# Altium project Naxida_Eyes_Up.PrjPcb
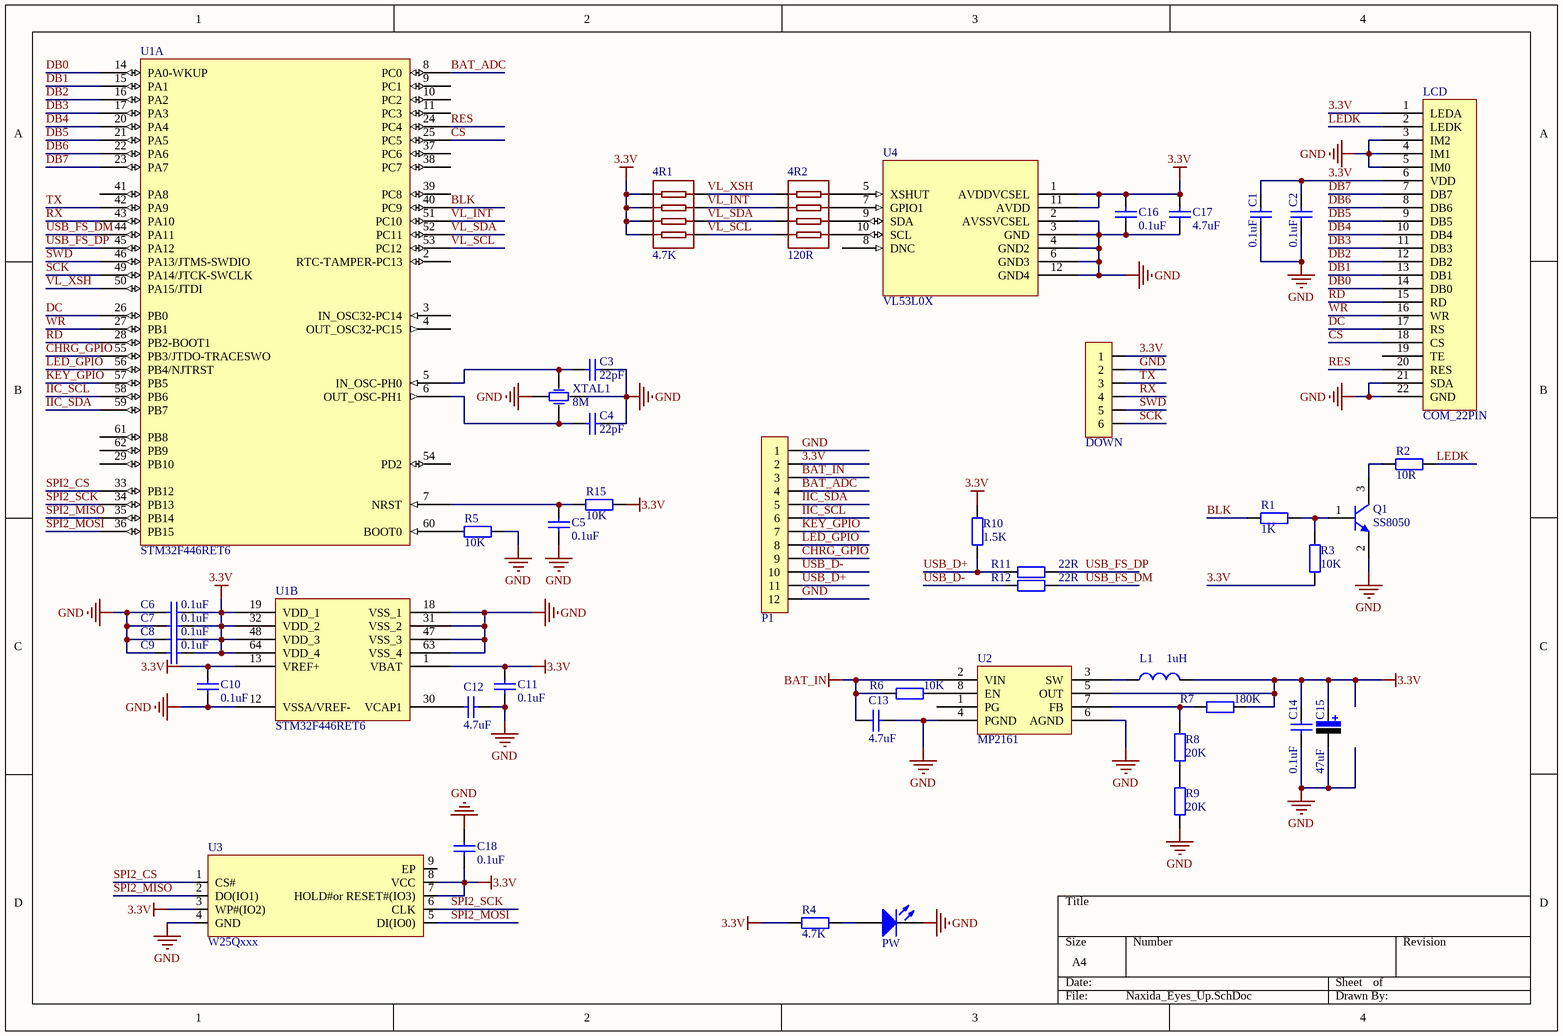
[diagram p0: Naxida_Eyes_Up.SchDoc]
1 sheet, 44 parts. Net scope: global (net labels, ports and power ports of the same name join across sheets).
Board file: Naxida_Eyes_Up.PcbDoc

## Sheet Naxida_Eyes_Up.SchDoc
size A4

### Parts
4R1  4.7K  [R_4R]
4R2  120R  [R_4R]
C1  0.1uF  [LC-0603_C]
C2  0.1uF  [LC-0603_C]
C3  value 22pF  [LC-0603_C]  (hidden comment: Cap)
C4  value 22pF  [LC-0603_C]  (hidden comment: Cap)
C5  0.1uF  [LC-0603_C]
C6  0.1uF  [LC-0603_C]
C7  0.1uF  [LC-0603_C]
C8  0.1uF  [LC-0603_C]
C9  0.1uF  [LC-0603_C]
C10  0.1uF  [LC-0603_C]
C11  0.1uF  [LC-0603_C]
C12  4.7uF  [LC-0603_C]
C13  4.7uF  [LC-1206_C]
C14  0.1uF  [LC-0603_C]
C15  47uF  [CAP-3528]
C16  0.1uF  [LC-0603_C]
C17  4.7uF  [LC-0603_C]
C18  0.1uF  [LC-0603_C]
DOWN  Header 6*1  [COM_W_2.0_6P]  (value not drawn)
L1  value 1uH  [Inductor-SWPA4030]  (hidden comment: Inductor)
LCD  COM_22PIN  [FPC_22PIN_0.5]
P1  Header 12*1  [HDR12X1_A-1.27mm]  (value not drawn)
PW  LED0  [LC-0603_LED_S1]  (value not drawn)
Q1  SS8050  [SOT-23]
R1  1K  [LC-0603_R]
R2  10R  [LC-0603_R]
R3  10K  [LC-0603_R]
R4  value 4.7K  [LC-0603_R]  (hidden comment: Res1)
R5  10K  [LC-0603_R]
R6  10K  [LC-0603_R]
R7  180K  [LC-0603_R]
R8  20K  [LC-0603_R]
R9  20K  [LC-0603_R]
R10  1.5K  [LC-0603_R]
R11  22R  [LC-0603_R]
R12  22R  [LC-0603_R]
R15  10K  [LC-0603_R]
U1  STM32F446RET6  [LQFP64_L]  (parts A,B of 2)
U2  MP2161  [SOT-23-8_MP2161]
U3  W25Qxxx  [WSON-8_W25Qxxx]
U4  VL53L0X  [VL53L0X]
XTAL1  8M  [XTAL_3225_4Pin]

### Nets
3.3V: 4R1.1 4R1.2 4R1.3 4R1.4 C1.2 C2.2 C6.2 C7.2 C8.2 C9.2 C10.2 C11.2 C14.2 C15.1 C16.2 C17.2 C18.1 DOWN.1 L1.2 LCD.1(LEDA) LCD.6(VDD) P1.2 R3.2 R4.1 R7.1 R10.1 R15.1 U1.1(VBAT) U1.13(VREF+) U1.19(VDD_1) U1.32(VDD_2) U1.48(VDD_3) U1.64(VDD_4) U2.5(OUT) U3.3(WP#(IO2)) U3.7(HOLD#or_RESET#(IO3)) U3.8(VCC) U4.1(AVDDVCSEL) U4.11(AVDD)
BAT_IN: C13.2 P1.3 R6.2 U2.2(VIN)
GND: C1.1 C2.1 C3.2 C4.2 C5.1 C6.1 C7.1 C8.1 C9.1 C10.1 C11.1 C12.1 C13.1 C14.1 C15.2 C16.1 C17.1 C18.2 DOWN.2 LCD.3(IM2) LCD.4(IM1) LCD.5(IM0) LCD.21(SDA) LCD.22(GND) P1.1 P1.12 PW.2(K) Q1.2(E) R5.1 R9.2 U1.12(VSSA/VREF-) U1.18(VSS_1) U1.31(VSS_2) U1.47(VSS_3) U1.63(VSS_4) U2.4(PGND) U2.6(AGND) U3.4(GND) U4.2(AVSSVCSEL) U4.3(GND) U4.4(GND2) U4.6(GND3) U4.12(GND4) XTAL1.2 XTAL1.4
BAT_ADC: P1.4 U1.8(PC0)
BLK: R1.2 U1.40(PC9)
CHRG_GPIO: P1.9 U1.55(PB3/JTDO-TRACESWO)
CS: LCD.18(CS) U1.25(PC5)
DB0: LCD.14(DB0) U1.14(PA0-WKUP)
DB1: LCD.13(DB1) U1.15(PA1)
DB2: LCD.12(DB2) U1.16(PA2)
DB3: LCD.11(DB3) U1.17(PA3)
DB4: LCD.10(DB4) U1.20(PA4)
DB5: LCD.9(DB5) U1.21(PA5)
DB6: LCD.8(DB6) U1.22(PA6)
DB7: LCD.7(DB7) U1.23(PA7)
DC: LCD.17(RS) U1.26(PB0)
IIC_SCL: P1.6 U1.58(PB6)
IIC_SDA: P1.5 U1.59(PB7)
KEY_GPIO: P1.7 U1.57(PB5)
LED_GPIO: P1.8 U1.56(PB4/NJTRST)
LEDK: LCD.2(LEDK) R2.1
RD: LCD.15(RD) U1.28(PB2-BOOT1)
RES: LCD.20(RES) U1.24(PC4)
RX: DOWN.4 U1.43(PA10)
SCK: DOWN.6 U1.49(PA14/JTCK-SWCLK)
SPI2_CS: U1.33(PB12) U3.1(CS#)
SPI2_MISO: U1.35(PB14) U3.2(DO(IO1))
SPI2_MOSI: U1.36(PB15) U3.5(DI(IO0))
SPI2_SCK: U1.34(PB13) U3.6(CLK)
SWD: DOWN.5 U1.46(PA13/JTMS-SWDIO)
TX: DOWN.3 U1.42(PA9)
USB_D+: P1.11 R10.2 R11.2
USB_D-: P1.10 R12.2
USB_FS_DM: R12.1 U1.44(PA11)
USB_FS_DP: R11.1 U1.45(PA12)
VL_INT: 4R1.7 4R2.2 U1.51(PC10)
VL_SCL: 4R1.5 4R2.4 U1.53(PC12)
VL_SDA: 4R1.6 4R2.3 U1.52(PC11)
VL_XSH: 4R1.8 4R2.1 U1.50(PA15/JTDI)
WR: LCD.16(WR) U1.27(PB1)
Net4R2_5: 4R2.5 U4.10(SCL)
Net4R2_6: 4R2.6 U4.9(SDA)
Net4R2_7: 4R2.7 U4.7(GPIO1)
Net4R2_8: 4R2.8 U4.5(XSHUT)
NetC3_1: C3.1 U1.5(IN_OSC-PH0) XTAL1.1
NetC4_1: C4.1 U1.6(OUT_OSC-PH1) XTAL1.3
NetC5_2: C5.2 R15.2 U1.7(NRST)
NetC12_2: C12.2 U1.30(VCAP1)
NetL1_1: L1.1 U2.3(SW)
NetPW_1: PW.1(A) R4.2
NetQ1_1: Q1.1(B) R1.1 R3.1
NetQ1_3: Q1.3(C) R2.2
NetR5_2: R5.2 U1.60(BOOT0)
NetR6_1: R6.1 U2.8(EN)
NetR7_2: R7.2 R8.1 U2.7(FB)
NetR8_2: R8.2 R9.1

Not connected (* = marked no-connect by the designer): LCD 19(TE); U1 2(RTC-TAMPER-PC13) 3(IN_OSC32-PC14) 4(OUT_OSC32-PC15) 9(PC1) 10(PC2) 11(PC3) 29(PB10) 37(PC6) 38(PC7) 39(PC8) 41(PA8) 54(PD2) 61(PB8) 62(PB9); U2 1(PG); U3 9(EP); U4 8(DNC)

### Library data of the parts
4R1 = 4R: pin to pad: 5>8 6>7 7>6 8>5
4R2 = 4R: pin to pad: 1>4 2>3 3>2 4>1 5>8 6>7 7>6 8>5
C1-C14 C16-C18 = Cap: 无极性电容; Published: 8-Jun-2000; LatestRevisionDate: 17-Jul-2002; LatestRevisionNote: Re-released for DXP Platform.; PackageReference: RAD-0.3; Publisher: Altium Limited
  C1 C2 C5-C11 C14 C16 C18: Value: 0.1uF
  C12 C13 C17: Value: 4.7uF
C15 = Cap Pol: 极性电解电容; Vol: 16V; Published: 8-Jun-2000; LatestRevisionDate: 17-Jul-2002; LatestRevisionNote: Re-released for DXP Platform.; PackageReference: RB7.6-15; Publisher: Altium Limited; Value: 47uF
DOWN = Header 6*1: 接插件; LatestRevisionDate: 17-Jul-2002; LatestRevisionNote: Re-released for DXP Platform.; Publisher: Altium Limited
L1 = Inductor: 电感; Code_IEC: 1005; Published: 8-Jun-2000; LatestRevisionDate: 17-Jul-2002; LatestRevisionNote: Re-released for DXP Platform.; PackageReference: 0402-A; Publisher: Altium Limited; Code_JEITA: 0402
P1 = Header 12*1: 接插件; LatestRevisionDate: 17-Jul-2002; LatestRevisionNote: Re-released for DXP Platform.; Publisher: Altium Limited
PW = LED0: 发光二极管; Published: 8-Jun-2000; LatestRevisionDate: 08-Jul-2005; LatestRevisionNote: Mech Layer 1 removed.; PackageReference: LED-0; Publisher: Altium Limited
Q1 = SS8050: NPN贴片三极管; Published: 8-Jun-2000; LatestRevisionDate: 15-Jan-2003; LatestRevisionNote: PCB Footprint 'BCY-W3/D4.7' replaced; DatasheetDocument: 1997; PackageDocument: Sep-1998; PackageReference: TO-92A; Publisher: Altium Limited; Code_JEDEC: TO-92A; ComponentLink1Description: Manufacturer Link; ComponentLink1URL: http://www.fairchildsemi.com/; ComponentLink2Description: Datasheet; ComponentLink2URL: http://www.fairchildsemi.com/ds/2N%2F2N3904.pdf
R1-R12 R15 = Res1: 贴片电阻; Published: 8-Jun-2000; LatestRevisionDate: 17-Jul-2002; LatestRevisionNote: Re-released for DXP Platform.; PackageReference: AXIAL-0.4; Publisher: Altium Limited
  R1: Value: 1K
  R2: Value: 10R
  R3 R5 R6 R15: Value: 10K
  R7: Value: 180K
  R8 R9: Value: 20K
  R10: Value: 1.5K
  R11 R12: Value: 22R
U1 = Y-STM32F446RET6
XTAL1 = XTAL_5032